# EAGLE design temp-sensor (EAGLE 9.6.2)
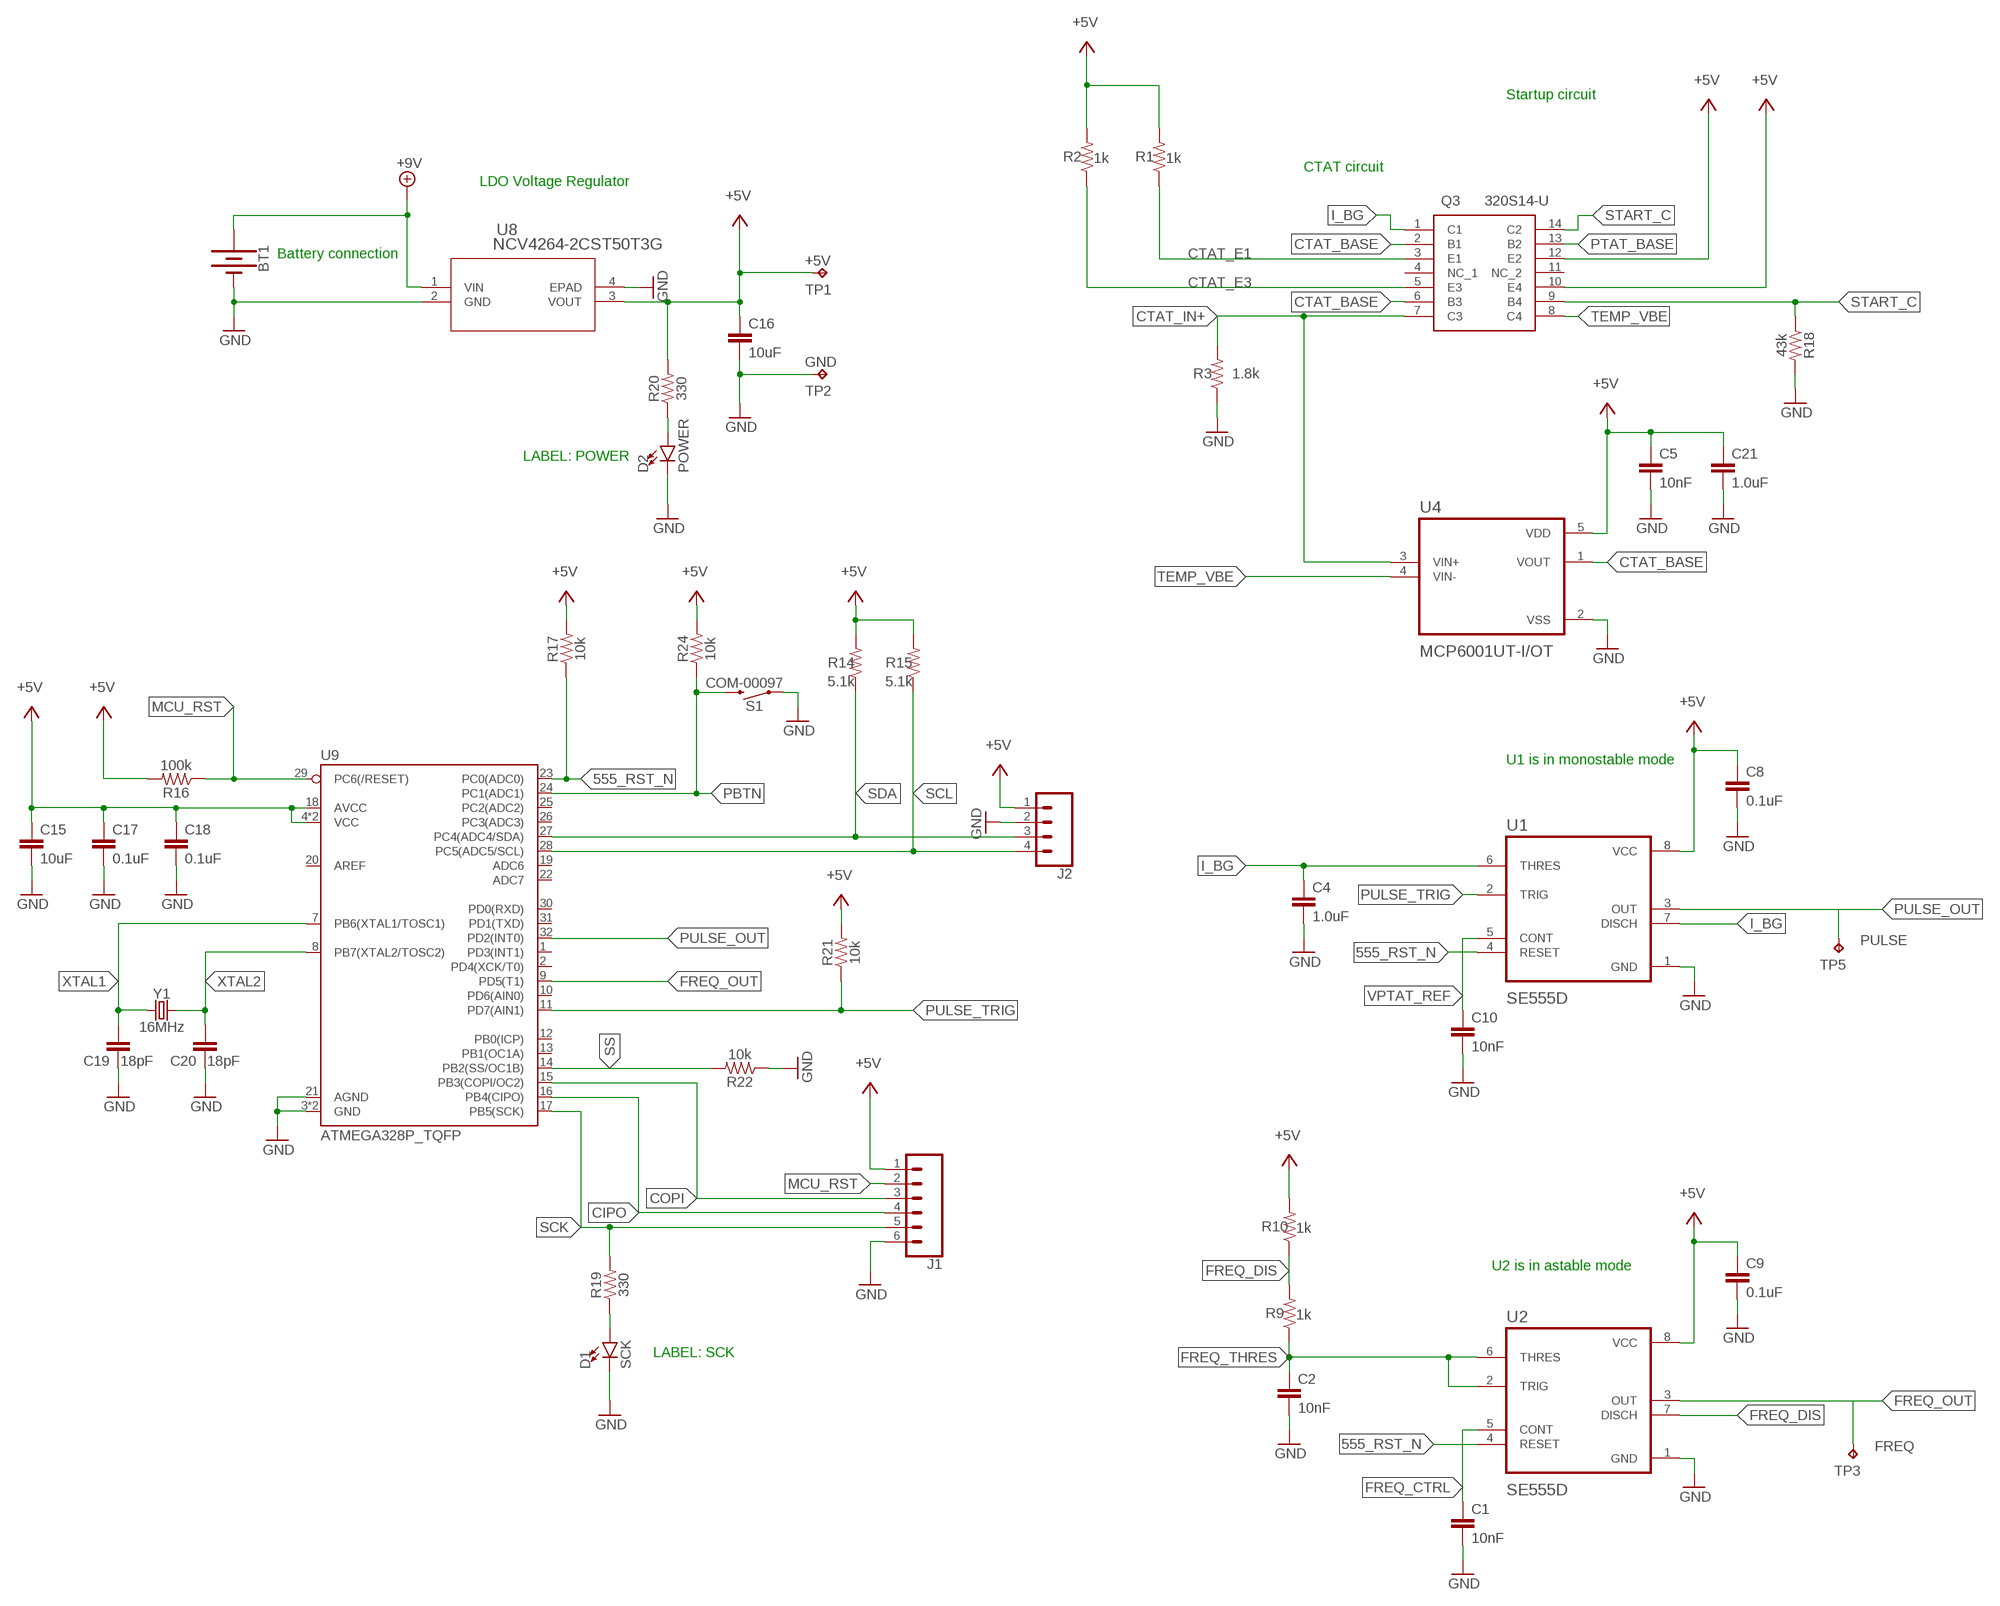
[diagram p0: schematic, sheet 1, part 1 of 2]
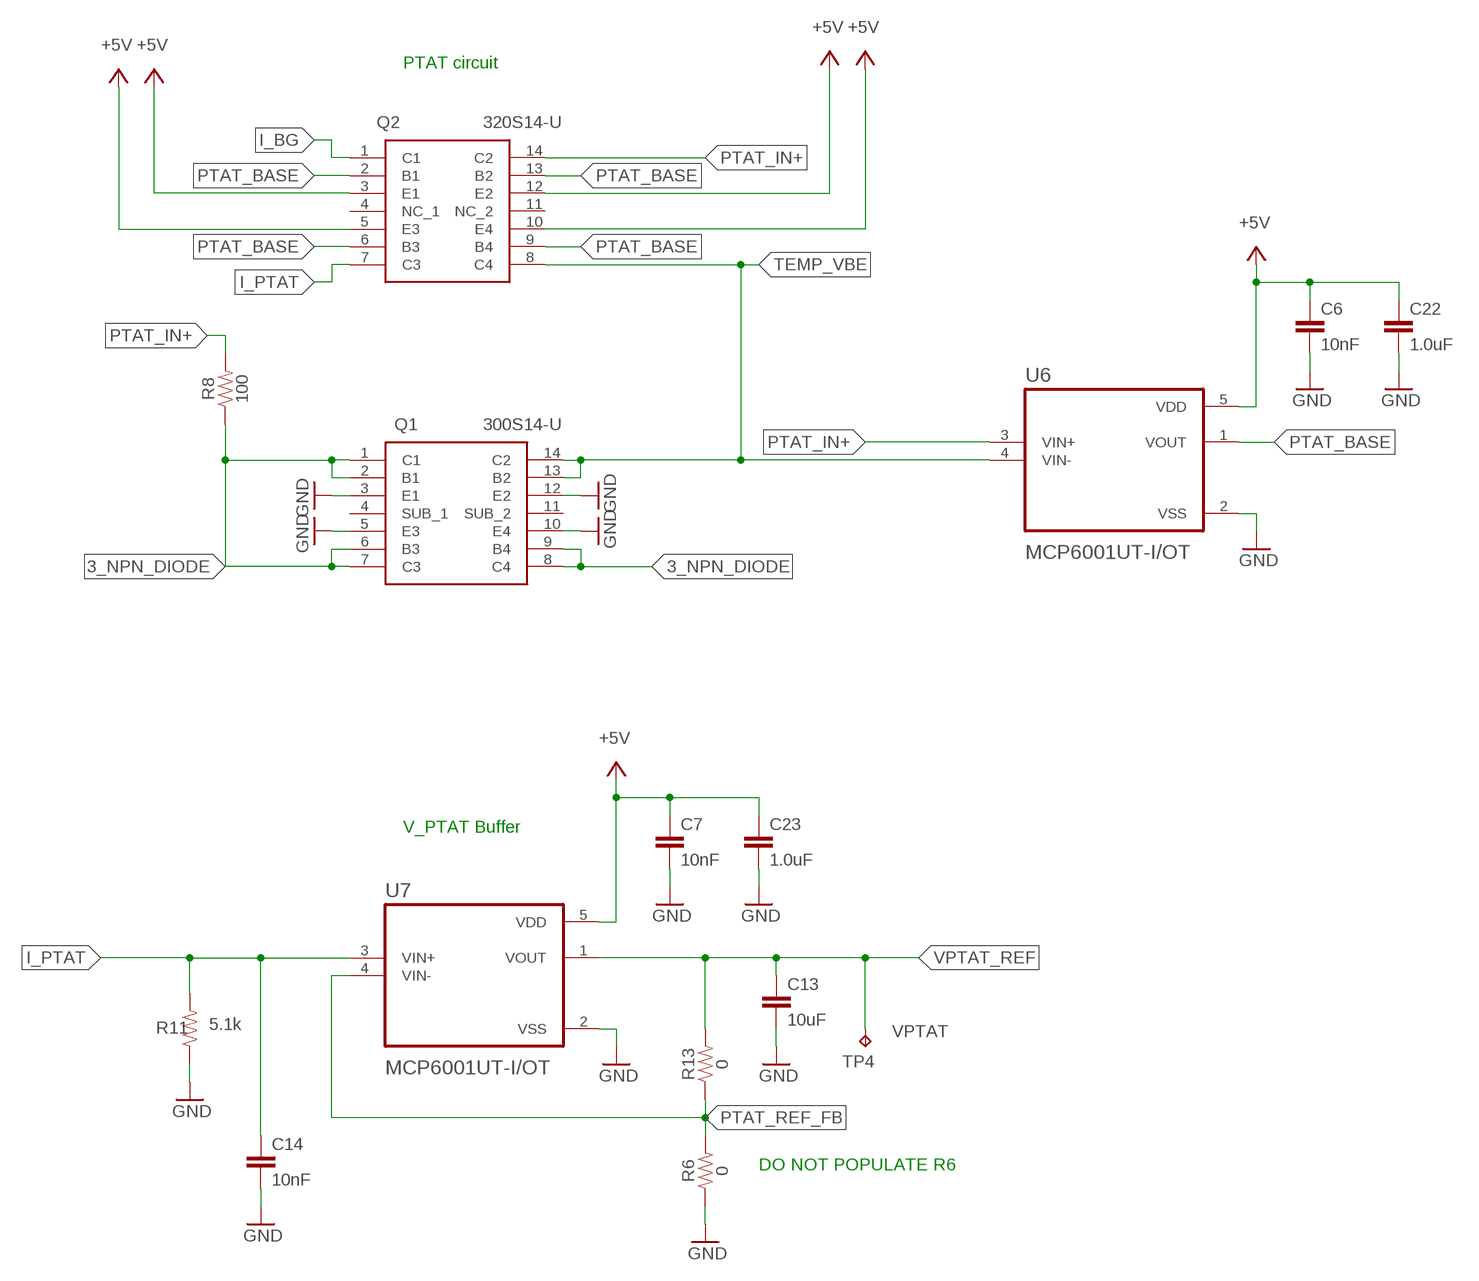
[diagram p1: schematic, sheet 1, part 2 of 2]

## Parts
BT1  BATTERY-9V  [BATTCON_9V]
C1  10nF  10NF-0603-50V-10%  [0603]
C2  10nF  10NF-0603-50V-10%  [0603]
C4  1.0uF  1.0UF-0603-16V-10%-X7R  [0603]
C5  10nF  10NF-0603-50V-10%  [0603]
C6  10nF  10NF-0603-50V-10%  [0603]
C7  10nF  10NF-0603-50V-10%  [0603]
C8  0.1uF  0.1UF-0603-25V-10%-X7R-WE  [0603]
C9  0.1uF  0.1UF-0603-25V-10%-X7R-WE  [0603]
C10  10nF  10NF-0603-50V-10%  [0603]
C13  10uF  10UF-0805-25V-10%  [0805]
C14  10nF  10NF-0603-50V-10%  [0603]
C15  10uF  10UF-0805-25V-10%  [0805]
C16  10uF  10UF-0805-25V-10%  [0805]
C17  0.1uF  0.1UF-0603-25V-10%-X7R-WE  [0603]
C18  0.1uF  0.1UF-0603-25V-10%-X7R-WE  [0603]
C19  18pF  18PF-0603-50V-5%  [0603]
C20  18pF  18PF-0603-50V-5%  [0603]
C21  1.0uF  1.0UF-0603-16V-10%-X7R  [0603]
C22  1.0uF  1.0UF-0603-16V-10%-X7R  [0603]
C23  1.0uF  1.0UF-0603-16V-10%-X7R  [0603]
D1  SCK  LED-GREEN1206  [LED-1206]
D2  POWER  LED-GREEN1206  [LED-1206]
J1  CONN_06SILK_FEMALE_PTH  [1X06]
J2  CONN_04PTH  [1X04]
Q1  300S14-U  [SOIC127P602X175-14N]
Q2  320S14-U  [SOIC127P602X175-14N]
Q3  320S14-U  [SOIC127P602X175-14N]
R1  1k  1KOHM-0603-1/10W-1%  [0603]
R2  1k  1KOHM-0603-1/10W-1%  [0603]
R3  1.8k  1.8KOHM-0603-1/10W-1%  [0603]
R6  0  0OHM-0603-1/10W  [0603]
R8  100  100OHM-0603-1/10W-1%  [0603]
R9  1k  1KOHM-0603-1/10W-1%  [0603]
R10  1k  1KOHM-0603-1/10W-1%  [0603]
R11  5.1k  5.1KOHM5.1KOHM-0603-1/10W-1%  [0603]
R13  0  0OHM-0603-1/10W  [0603]
R14  5.1k  5.1KOHM5.1KOHM-0603-1/10W-1%  [0603]
R15  5.1k  5.1KOHM5.1KOHM-0603-1/10W-1%  [0603]
R16  100k  100KOHM-0603-1/10W-1%  [0603]
R17  10k  10KOHM-0603-1/10W-1%  [0603]
R18  43k  43KOHM-0603-1/10W-1%  [0603]
R19  330  330OHM-0603-1/10W-1%  [0603]
R20  330  330OHM-0603-1/10W-1%  [0603]
R21  10k  10KOHM-0603-1/10W-1%  [0603]
R22  10k  10KOHM-0603-1/10W-1%  [0603]
R24  10k  10KOHM-0603-1/10W-1%  [0603]
S1  MOMENTARY-SWITCH-SPST-PTH-6.0MM  [TACTILE_SWITCH_PTH_6.0MM]
TP1  TPPAD1-13  [P1-13]
TP2  TPPAD1-13  [P1-13]
TP3  TPPAD1-13  [P1-13]
TP4  TPPAD1-13  [P1-13]
TP5  TPPAD1-13  [P1-13]
U1  SE555D  [SOIC127P599X175-8N]
U2  SE555D  [SOIC127P599X175-8N]
U4  MCP6001UT-I/OT  [SOT95P270X145-5N]
U6  MCP6001UT-I/OT  [SOT95P270X145-5N]
U7  MCP6001UT-I/OT  [SOT95P270X145-5N]
U8  NCV4264-2CST50T3G  [SOT-223_ONS]
U9  ATMEGA328P_TQFP  [TQFP32-08]
Y1  16MHz  CRYSTAL-16MHZSMD-5X3.2  [CRYSTAL-SMD-5X3.2-4PAD]

## Nets
3_NPN_DIODE: Q1.1(C1) Q1.2(B1) Q1.6(B3) Q1.7(C3) Q1.8(C4) Q1.9(B4) R8.1
555_RST_N: R17.1 U1.4(RESET) U2.4(RESET) U9.23(PC0(ADC0))
+5V: C5.1 C6.1 C7.1 C8.1 C9.1 C15.1 C16.1 C17.1 C18.1 C21.1 C22.1 C23.1 J1.1 J2.1 Q2.3(E1) Q2.5(E3) Q2.10(E4) Q2.12(E2) Q3.10(E4) Q3.12(E2) R1.2 R2.2 R10.2 R14.2 R15.2 R16.2 R17.2 R20.2 R21.2 R24.2 TP1.TP U1.8(VCC) U2.8(VCC) U4.5(VDD) U6.5(VDD) U7.5(VDD) U8.3(VOUT) U9.4(VCC) U9.6(VCC) U9.18(AVCC)
+9V: BT1.+ U8.1(VIN)
CIPO: J1.4 U9.16(PB4(CIPO))
COPI: J1.3 U9.15(PB3(COPI/OC2))
CTAT_BASE: Q3.2(B1) Q3.6(B3) U4.1(VOUT)
CTAT_E1: Q3.3(E1) R1.1
CTAT_E3: Q3.5(E3) R2.1
CTAT_IN+: Q3.7(C3) R3.2 U4.3(VIN+)
FREQ_CTRL: C1.1 U2.5(CONT)
FREQ_DIS: R9.2 R10.1 U2.7(DISCH)
FREQ_OUT: TP3.TP U2.3(OUT) U9.9(PD5(T1))
FREQ_THRES: C2.1 R9.1 U2.2(TRIG) U2.6(THRES)
GND: BT1.- C1.2 C2.2 C4.2 C5.2 C6.2 C7.2 C8.2 C9.2 C10.2 C13.2 C14.2 C15.2 C16.2 C17.2 C18.2 C19.1 C20.1 C21.2 C22.2 C23.2 D1.C D2.C J1.6 J2.2 Q1.3(E1) Q1.5(E3) Q1.10(E4) Q1.12(E2) R3.1 R6.1 R11.1 R18.2 R22.1 S1.1 TP2.TP U1.1(GND) U2.1(GND) U4.2(VSS) U6.2(VSS) U7.2(VSS) U8.2(GND) U8.4(EPAD) U9.3(GND) U9.5(GND) U9.21(AGND)
I_BG: C4.1 Q2.1(C1) Q3.1(C1) U1.6(THRES) U1.7(DISCH)
I_PTAT: C14.1 Q2.7(C3) R11.2 U7.3(VIN+)
MCU_RST: J1.2 R16.1 U9.29(PC6(/RESET))
N$2: D1.A R19.1
N$3: D2.A R20.1
PBTN: R24.1 S1.3 U9.24(PC1(ADC1))
PTAT_BASE: Q2.2(B1) Q2.6(B3) Q2.9(B4) Q2.13(B2) Q3.13(B2) U6.1(VOUT)
PTAT_IN+: Q2.14(C2) R8.2 U6.3(VIN+)
PTAT_REF_FB: R6.2 R13.1 U7.4(VIN-)
PULSE_OUT: TP5.TP U1.3(OUT) U9.32(PD2(INT0))
PULSE_TRIG: R21.1 U1.2(TRIG) U9.11(PD7(AIN1))
SCK: J1.5 R19.2 U9.17(PB5(SCK))
SCL: J2.4 R15.1 U9.28(PC5(ADC5/SCL))
SDA: J2.3 R14.1 U9.27(PC4(ADC4/SDA))
SS: R22.2 U9.14(PB2(SS/OC1B))
START_C: Q3.9(B4) Q3.14(C2) R18.1
TEMP_VBE: Q1.13(B2) Q1.14(C2) Q2.8(C4) Q3.8(C4) U4.4(VIN-) U6.4(VIN-)
VPTAT_REF: C10.1 C13.1 R13.2 TP4.TP U1.5(CONT) U7.1(VOUT)
XTAL1: C19.2 U9.7(PB6(XTAL1/TOSC1)) Y1.1
XTAL2: C20.2 U9.8(PB7(XTAL2/TOSC2)) Y1.3
Unconnected: Q1.4(SUB_1) Q1.11(SUB_2) Q2.4(NC_1) Q2.11(NC_2) Q3.4(NC_1) Q3.11(NC_2) U9.1(PD3(INT1)) U9.2(PD4(XCK/T0)) U9.10(PD6(AIN0)) U9.12(PB0(ICP)) U9.13(PB1(OC1A)) U9.19(ADC6) U9.20(AREF) U9.22(ADC7) U9.25(PC2(ADC2)) U9.26(PC3(ADC3)) U9.30(PD0(RXD)) U9.31(PD1(TXD))

## Notes on the sheet
- Startup circuit
- CTAT circuit | PTAT circuit
- LDO Voltage Regulator
- Battery connection
- LABEL: POWER
- U1 is in monostable mode
- V_PTAT Buffer
- DO NOT POPULATE R6
- U2 is in astable mode
- LABEL: SCK

## Library data of the parts
BT1 = SparkFun-Batteries:BATTERY: Battery - Single Cell A variety of battery chemistries, sizes, and footprints. Device List: 20MM_PTH - Coin Cell Battery Holder - 20mm (PTH) <https://www.sparkfun.com/products/783> 20MM_PTH_KIT- Coin Cell battery Holder - 20 mm (PTH) <http://www.sparkfun.com/products/783>kit version with special mask 6.8MM_PTH - Coin Cell Battery Holder - 6.8MM(SMD) <https://www.digikey.com/product-detail/en/seiko-instruments/MS621FE-FL11E/728-1057-ND/1889208?WT.srch=1&gclid=CNOQ5a6LzdQCFZS2wAodXCkE0g> 12MM_SMD - Coin Cell Battery Holder - 12mm (SMD) <https://www.sparkfun.com/products/10592> 12MM_PTH - Coin Cell Battery Holder - 12mm (PTH) <https://www.sparkfun.com/products/7948> 20MM_SMD - 20mm Coin Cell Battery Holder (SMD) (2 legs) Used on the Big Time Watch Kit <https://www.sparkfun.com/products/11734> 20MM_SMD_4LEGS - Coin Cell Battery Holder - 20mm (SMD) <https://www.sparkfun.com/products/11892> 20MM_SMD_4LEGS_OVERPASTE - Coin Cell Battery Holder - 20mm (SMD) <https://www.sparkfun.com/products/11892> (Over-paste on the legs) 24.5MM_PTH - Coin Cell Battery Holder - 24.5mm (PTH) <https://www.sparkfun.com/products/8863> 9V - 9V Battery Holder - PC Mount Used on the SparkFun SparkPunk Sound Kit <https://www.sparkfun.com/products/11177> and SparkFun SparkPunk Sequencer Kit <https://www.sparkfun.com/products/12707> 18650 - Battery Holder - 18650 (PTH) <https://www.sparkfun.com/products/13113> AA - Battery Holder - 1xAA (PTH) <https://www.sparkfun.com/products/7949> AAA - Battery Holder - 1xAAA (PTH) <https://www.sparkfun.com/products/12718> AA_KIT - Battery Holder - 1xAA (PTH) <https://www.sparkfun.com/products/7949> Special kit package - pads only have exposed copper on one side of the board. AAA_KIT - Battery Holder - 1xAAA (PTH) <https://www.sparkfun.com/products/12718> Special kit package - pads only have exposed copper on one side of the board.; PROD_ID: BATT-10855
C1 C2 C5-C7 C10 C14 = SparkFun-Capacitors:10NF: 0.01uF/10nF/10,000pF ceramic capacitors A capacitor is a passive two-terminal electrical component used to store electrical energy temporarily in an electric field. CAP-09321; PROD_ID: CAP-00867
C4 C21-C23 = SparkFun-Capacitors:1.0UF: 1µF ceramic capacitors A capacitor is a passive two-terminal electrical component used to store electrical energy temporarily in an electric field.; PROD_ID: CAP-13930
C8 C9 C17 C18 = SparkFun-Capacitors:0.1UF: 0.1µF ceramic capacitors A capacitor is a passive two-terminal electrical component used to store electrical energy temporarily in an electric field.; PROD_ID: CAP-16503
C13 C15 C16 = SparkFun-Capacitors:10UF: 10.0µF ceramic capacitors A capacitor is a passive two-terminal electrical component used to store electrical energy temporarily in an electric field.; PROD_ID: CAP-14259
C19 C20 = SparkFun-Capacitors:18PF: 18pF ceramic capacitors A capacitor is a passive two-terminal electrical component used to store electrical energy temporarily in an electric field.; PROD_ID: CAP-08267
D1 D2 = SparkFun-LED:LED-GREEN: Green SMD LED Used in manufacturing of various products at SparkFun Packages: 0603 - SMD 0603 package [Product Link] <http://www.futureelectronics.com/en/technologies/semiconductors/optoelectronics/leds/Pages/9894312-LTST-C190GKT.aspx?CrossPart=HSMG-C190&IM=0> LilyPad 1206 - SMD1206 LilyPad package [Product Link] <http://www.futureelectronics.com/en/Technologies/Product.aspx?ProductID=IN150NGHARVATEKCORPORATION2049943&IM=0> 1206 - SMD1206 package [Product Link] <http://www.futureelectronics.com/en/technologies/semiconductors/optoelectronics/leds/Pages/8315665-LTST-C150KGKT.aspx?IM=0> 1206 Bottom Mount -SMD 1206 Bottom Mount [Product Link] <http://www.digikey.com/product-detail/en/lite-on-inc/LTST-C230KGKT/160-1456-1-ND/386854> SparkFun Products: Pro Mini 328 -5V <https://www.sparkfun.com/products/821> RedBoard <https://www.sparkfun.com/products/12757> MP3 Trigger <https://www.sparkfun.com/products/13720> Makey Makey <https://www.sparkfun.com/products/11076>; PROD_ID: DIO-00862; VALUE: GREEN
J1 = SparkFun-Connectors:CONN_06: Multi connection point. Often used as Generic Header-pin footprint for 0.1 inch spaced/style header connections On any of the 0.1 inch spaced packages, you can populate with these: Break Away Headers - Straight <https://www.sparkfun.com/products/116> (PRT-00116) Break Away Male Headers - Right Angle <https://www.sparkfun.com/products/553> (PRT-00553) Female Headers <https://www.sparkfun.com/products/115> (PRT-00115) Break Away Headers - Machine Pin <https://www.sparkfun.com/products/117> (PRT-00117) Break Away Female Headers - Swiss Machine Pin <https://www.sparkfun.com/products/743> (PRT-00743) Arduino Stackable Header - 6 Pin <https://www.sparkfun.com/products/9280> (PRT-09280) Screw Terminals 2.54mm Pitch (6-Pin) <https://www.sparkfun.com/products/16499> (PRT-16499) For SCREWTERMINALS and SPRING TERMINALS visit here: Screw Terimnals on SparkFun.com <https://www.sparkfun.com/search/results?term=Screw+Terminals> (5mm/3.5mm/2.54mm spacing) This device is also useful as a general connection point to wire up your design to another part of your project. Our various solder wires solder well into these plated through hole pads. Hook-Up Wire - Assortment (Stranded, 22 AWG) <https://www.sparkfun.com/products/11375> (PRT-11375) Hook-Up Wire - Assortment (Solid Core, 22 AWG) <https://www.sparkfun.com/products/11367> (PRT-11367) View the entire wire category on our website here <https://www.sparkfun.com/categories/141>; PROD_ID: CONN-08437
J2 = SparkFun-Connectors:CONN_04: Multi connection point. Often used as Generic Header-pin footprint for 0.1 inch spaced/style header connections On any of the 0.1 inch spaced packages, you can populate with these: Break Away Headers - Straight <https://www.sparkfun.com/products/116> (PRT-00116) Break Away Male Headers - Right Angle <https://www.sparkfun.com/products/553> (PRT-00553) Female Headers <https://www.sparkfun.com/products/115> (PRT-00115) Break Away Headers - Machine Pin <https://www.sparkfun.com/products/117> (PRT-00117) Break Away Female Headers - Swiss Machine Pin <https://www.sparkfun.com/products/743> (PRT-00743) For SCREWTERMINALS and SPRING TERMINALS visit here: Screw Terimnals on SparkFun.com <https://www.sparkfun.com/search/results?term=Screw+Terminals> (5mm/3.5mm/2.54mm spacing) This device is also useful as a general connection point to wire up your design to another part of your project. Our various solder wires solder well into these plated through hole pads. Hook-Up Wire - Assortment (Stranded, 22 AWG) <https://www.sparkfun.com/products/11375> (PRT-11375) Hook-Up Wire - Assortment (Solid Core, 22 AWG) <https://www.sparkfun.com/products/11367> (PRT-11367) View the entire wire category on our website here <https://www.sparkfun.com/categories/141> Special notes: Molex polarized connector foot print use with SKU : PRT-08231 with associated crimp pins and housings. 1MM SMD Version SKU: PRT-10208; PROD_ID: CONN-09696
Q1 = 300S14-U:300S14-U: Bipolar Transistors - BJT 4 NPN Matched Trans. Array SO-14 Source: Datasheet; DESCRIPTION: Bipolar Transistors - BJT 4 NPN Matched Trans. Array SO-14; HEIGHT: 1.75mm; MANUFACTURER_NAME: THAT CORPORATION; MANUFACTURER_PART_NUMBER: 300S14-U; MOUSER_PART_NUMBER: 887-300S14-U; MOUSER_PRICE-STOCK: https://www.mouser.co.uk/ProductDetail/THAT/300S14-U?qs=wN%2Fcur4AVWdHgHcGlLafqA%3D%3D
Q2 Q3 = 320S14-U:320S14-U: Bipolar Transistors - BJT 4 PNP Matched Trans. Array SO-14 Source: Datasheet <http://www.thatcorp.com/datashts/THAT_300-Series_Datasheet.pdf>; DESCRIPTION: Bipolar Transistors - BJT 4 PNP Matched Trans. Array SO-14; HEIGHT: 1.75mm; MANUFACTURER_NAME: THAT CORPORATION; MANUFACTURER_PART_NUMBER: 320S14-U; MOUSER_PART_NUMBER: 887-320S14-U; MOUSER_PRICE-STOCK: https://www.mouser.co.uk/ProductDetail/THAT/320S14-U?qs=9Udfh7QmL4u%252BQY2LzA4HXA%3D%3D
R1 R2 R9 R10 = SparkFun-Resistors:1KOHM: 1kΩ resistor A resistor is a passive two-terminal electrical component that implements electrical resistance as a circuit element. Resistors act to reduce current flow, and, at the same time, act to lower voltage levels within circuits. - Wikipedia; PROD_ID: RES-07856
R3 = SparkFun-Resistors:1.8KOHM: 1.8kΩ resistor A resistor is a passive two-terminal electrical component that implements electrical resistance as a circuit element. Resistors act to reduce current flow, and, at the same time, act to lower voltage levels within circuits. - Wikipedia; PROD_ID: RES-09119
R6 R13 = SparkFun-Resistors:0OHM: 0Ω resistor A resistor is a passive two-terminal electrical component that implements electrical resistance as a circuit element. Resistors act to reduce current flow, and, at the same time, act to lower voltage levels within circuits. - Wikipedia; PROD_ID: RES-08609
R8 = SparkFun-Resistors:100OHM: 100Ω resistor A resistor is a passive two-terminal electrical component that implements electrical resistance as a circuit element. Resistors act to reduce current flow, and, at the same time, act to lower voltage levels within circuits. - Wikipedia; PROD_ID: RES-07863
R11 R14 R15 = SparkFun-Resistors:5.1KOHM; PROD_ID: RES-12083
R16 = SparkFun-Resistors:100KOHM: 100kΩ resistor A resistor is a passive two-terminal electrical component that implements electrical resistance as a circuit element. Resistors act to reduce current flow, and, at the same time, act to lower voltage levels within circuits. - Wikipedia; PROD_ID: RES-07828
R17 R21 R22 R24 = SparkFun-Resistors:10KOHM: 10kΩ resistor A resistor is a passive two-terminal electrical component that implements electrical resistance as a circuit element. Resistors act to reduce current flow, and, at the same time, act to lower voltage levels within circuits. - Wikipedia; PROD_ID: RES-00824
R18 = SparkFun-Resistors:43KOHM: 43kΩ resistor A resistor is a passive two-terminal electrical component that implements electrical resistance as a circuit element. Resistors act to reduce current flow, and, at the same time, act to lower voltage levels within circuits. - Wikipedia; PROD_ID: RES-07858
R19 R20 = SparkFun-Resistors:330OHM: 330Ω resistor A resistor is a passive two-terminal electrical component that implements electrical resistance as a circuit element. Resistors act to reduce current flow, and, at the same time, act to lower voltage levels within circuits. - Wikipedia; PROD_ID: RES-00818
S1 = SparkFun-Switches:MOMENTARY-SWITCH-SPST: Momentary Switch (Pushbutton) - SPST Normally-open (NO) SPST momentary switches (buttons, pushbuttons). Variants PTH-12MM - 12mm square, through-hole Momentary Pushbutton Switch - 12mm Square <https://www.sparkfun.com/products/9190> (COM-09190) PTH-6.0MM, PTH-6.0MM-KIT - 6.0mm square, through-hole Mini Pushbutton Switch <https://www.sparkfun.com/products/97> (COM-00097) KIT package intended for soldering kit's - only one side of pads' copper is exposed. PTH-RIGHT-ANGLE-KIT - Right-angle, through-hole Right Angle Tactile Button <https://www.sparkfun.com/products/10791> - Used on SparkFun BigTime Watch Kit <https://www.sparkfun.com/products/11734> SMD-12MM - 12mm square, surface-mount Tactile Button - SMD (12mm) <https://www.sparkfun.com/products/12993> (COM-12993) Used on SparkFun PicoBoard <https://www.sparkfun.com/products/11888> SMD-4.5MM - 4.5mm Square Trackball Switch Used on SparkFun Blackberry Trackballer Breakout <https://www.sparkfun.com/products/13169> SMD-4.6MMX2.8MM - 4.60mm x 2.80mm, surface mount Used on SparkFun Pro Micro - RP2040 <https://www.sparkfun.com/products/17717> SMD-5.2MM, SMD-5.2-REDUNDANT - 5.2mm square, surface-mount Mini Pushbutton Switch - SMD <https://www.sparkfun.com/products/8720> (COM-08720) Used on Arduino Pro Mini <https://www.sparkfun.com/products/11114> REDUNDANT package connects both switch circuits together SMD-6.0X3.5MM - 6.0 x 3.5mm, surface mount Momentary Reset Switch SMD <https://www.sparkfun.com/products/8229> (COM-08229) SMD-6.2MM-TALL - 6.2mm square, surface mount Tactile Button - SMD (6mm) <https://www.sparkfun.com/products/12992> Used on SparkFun Digital Sandbox <https://www.sparkfun.com/products/12651> SMD-RIGHT-ANGLE - Right-angle, surface mount Used on SparkFun Block for Intel® Edison - Arduino <https://www.sparkfun.com/products/13036>; PROD_ID: SWCH-08441; SF_SKU: COM-00097
TP1 = testpad:TP: Test pad; TP_SIGNAL_NAME: +5V
TP2 = testpad:TP: Test pad; TP_SIGNAL_NAME: GND
TP3 = testpad:TP: Test pad; TP_SIGNAL_NAME: FREQ
TP4 = testpad:TP: Test pad; TP_SIGNAL_NAME: VPTAT
TP5 = testpad:TP: Test pad; TP_SIGNAL_NAME: PULSE
U1 U2 = SE555D:SE555D: None Check availability <https://pricing.snapeda.com/parts/SE555D/Texas%20Instruments/view-part?ref=eda>; AVAILABILITY: In Stock; CHECK_PRICES: https://www.snapeda.com/parts/SE555D/Texas+Instruments/view-part/?ref=eda; DESCRIPTION: Precision timer for -55 to 125C operation; MF: Texas Instruments; MP: SE555D; PACKAGE: SOIC-8 Texas Instruments; PRICE: None; PURCHASE-URL: https://www.snapeda.com/api/url_track_click_mouser/?unipart_id=4805641&manufacturer=Texas Instruments&part_name=SE555D&search_term=se555d; SNAPEDA_LINK: https://www.snapeda.com/parts/SE555D/Texas+Instruments/view-part/?ref=snap
U4 U6 U7 = MCP6001UT-I_OT:MCP6001UT-I/OT
U8 = NCV4264-2CST50T3G:NCV4264-2CST50T3G; COPYRIGHT: Copyright (C) 2024 Ultra Librarian. All rights reserved.; MANUFACTURER_PART_NUMBER: NCV4264-2CST50T3G; MFR_NAME: onsemi
U9 = SparkFun-IC-Microcontroller:ATMEGA328P_TQFP: Popular 328P in QFP Storefront component: ATmega328 - TQFP <https://www.sparkfun.com/products/13448> (COM-13448) Datasheet <http://www.sparkfun.com/datasheets/Components/SMD/ATMega328.pdf> SparkFun Products SparkFun RedBoard - Programmed with Arduino <https://www.sparkfun.com/products/12757> (DEV-12757) Arduino Pro Mini 328 - 5V/16MHz <https://www.sparkfun.com/products/11113> (DEV-11113) Arduino Pro Mini 328 - 3.3V/8MHz <https://www.sparkfun.com/products/11114> (DEV-11114) SparkFun OpenLog <https://www.sparkfun.com/products/13712> (DEV-13712) SparkFun MicroView - OLED Arduino Module <https://www.sparkfun.com/products/12923> (DEV-12923) SparkFun Digital Sandbox <https://www.sparkfun.com/products/12651> (DEV-12651) SparkFun PicoBoard <https://www.sparkfun.com/products/11888> (WIG-11888) Arduino Fio <https://www.sparkfun.com/products/10116> (DEV-10116) LilyPad Arduino 328 Main Board <https://www.sparkfun.com/products/13342> (DEV-13342) SparkFun RedStick <https://www.sparkfun.com/products/13741> (DEV-13741) LilyPad MP3 <https://www.sparkfun.com/products/11013> (DEV-11013) LilyPad Arduino SimpleSnap <https://www.sparkfun.com/products/10941> (DEV-10941) SparkFun Stepoko <https://www.sparkfun.com/products/13899> (ROB-13899) SparkFun Geiger Counter <https://www.sparkfun.com/products/11345> (SEN-11345) SparkFun EL Sequencer <https://www.sparkfun.com/products/12781> (COM-12781) Arduino Pro 328 - 5V/16MHz <https://www.sparkfun.com/products/10915> (DEV-10915) CryptoCape <https://www.sparkfun.com/products/12773> (DEV-12773) SparkFun IR Thermometer Evaluation Board - MLX90614 <https://www.sparkfun.com/products/10740> (SEN-10740) SparkFun RedBot Mainboard <https://www.sparkfun.com/products/12097> (ROB-12097) Arduino Pro 328 - 3.3V/8MHz <https://www.sparkfun.com/products/10914> (DEV-10914) SparkFun Block for Intel® Edison - Arduino <https://www.sparkfun.com/products/13036> (DEV-13036) SparkFun Simon Says - Surface Mount Soldering Kit <https://www.sparkfun.com/products/10935> (KIT-10935) SparkFun 7-Segment Serial Display - Red <https://www.sparkfun.com/products/11441> (COM-11441) SparkFun 7-Segment Serial Display - White <https://www.sparkfun.com/products/11629> (COM-11629) SparkFun 7-Segment Serial Display - Yellow <https://www.sparkfun.com/products/11443> (COM-11443) SparkFun 7-Segment Serial Display - Kelly Green <https://www.sparkfun.com/products/11440> (COM-11440) SparkFun 7-Segment Serial Display - Blue <https://www.sparkfun.com/products/11442> (COM-11442) SparkFun OpenSegment Serial Display - 20mm (Blue) <https://www.sparkfun.com/products/11647> (COM-11647) SparkFun OpenSegment Serial Display - 20mm (Green) <https://www.sparkfun.com/products/11646> (COM-11646) SparkFun OpenSegment Serial Display - 20mm (White) <https://www.sparkfun.com/products/11648> (COM-11648) SparkFun OpenSegment Serial Display - 20mm (Red) <https://www.sparkfun.com/products/11644> (COM-11644) SparkFun OpenSegment Serial Display - 20mm (Yellow) <https://www.sparkfun.com/products/11645> (COM-11645) SparkFun OpenSegment Shield <https://www.sparkfun.com/products/13190> (DEV-13190); PROD_ID: IC-09069
Y1 = SparkFun-Clocks:CRYSTAL-16MHZ: 16MHz Crystal Digikey Example <http://www.digikey.com/product-search/en?keywords=535-9122-1-ND> Frequency: 16MHz Frequency Stability: ±50ppm Frequency Tolerance: ±20ppm Load Capacitance: 18pF SparkFun Products: Pro Micro -5V/16MHz <https://www.sparkfun.com/products/12640> SparkFun Serial Enabled LCD Kit <https://www.sparkfun.com/products/10097>; PROD_ID: XTAL-08218; SF_ID: COM-00094

## Board
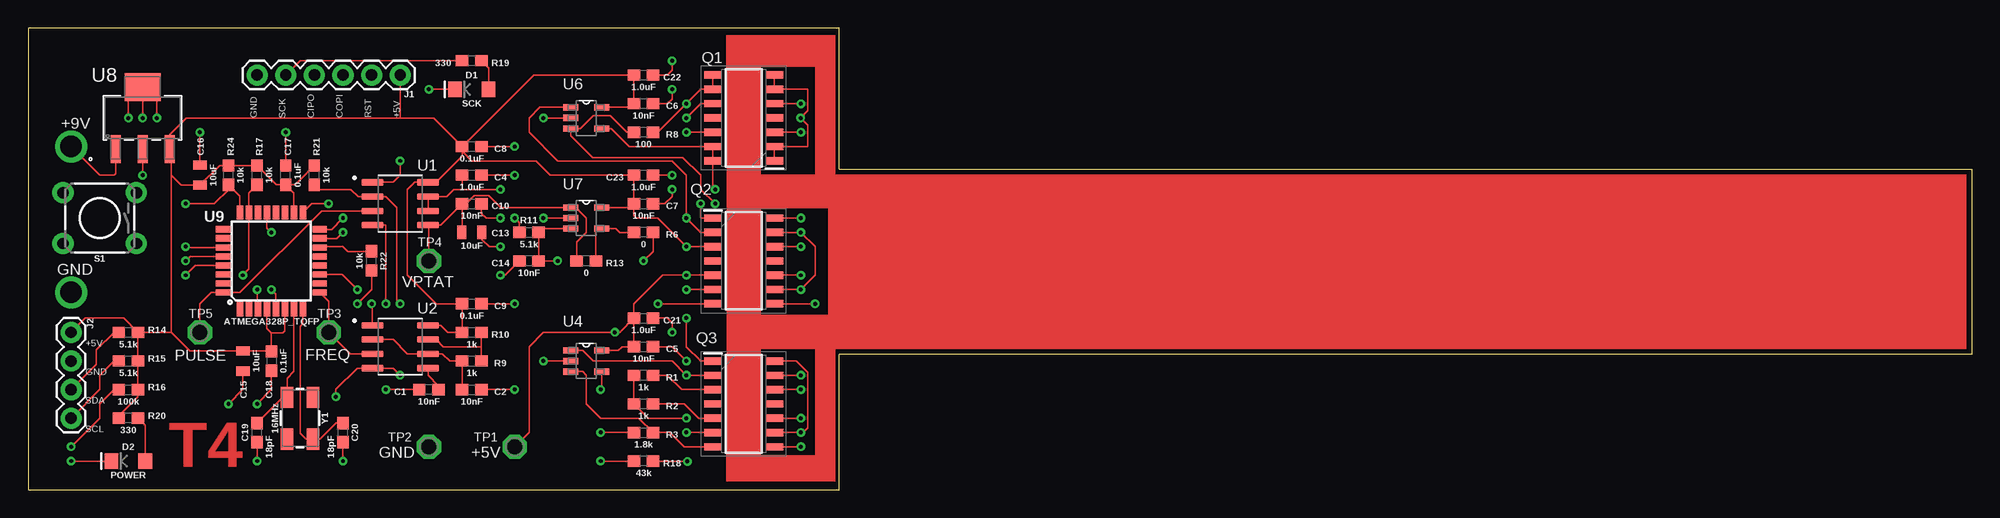
[diagram p2: board, top side]
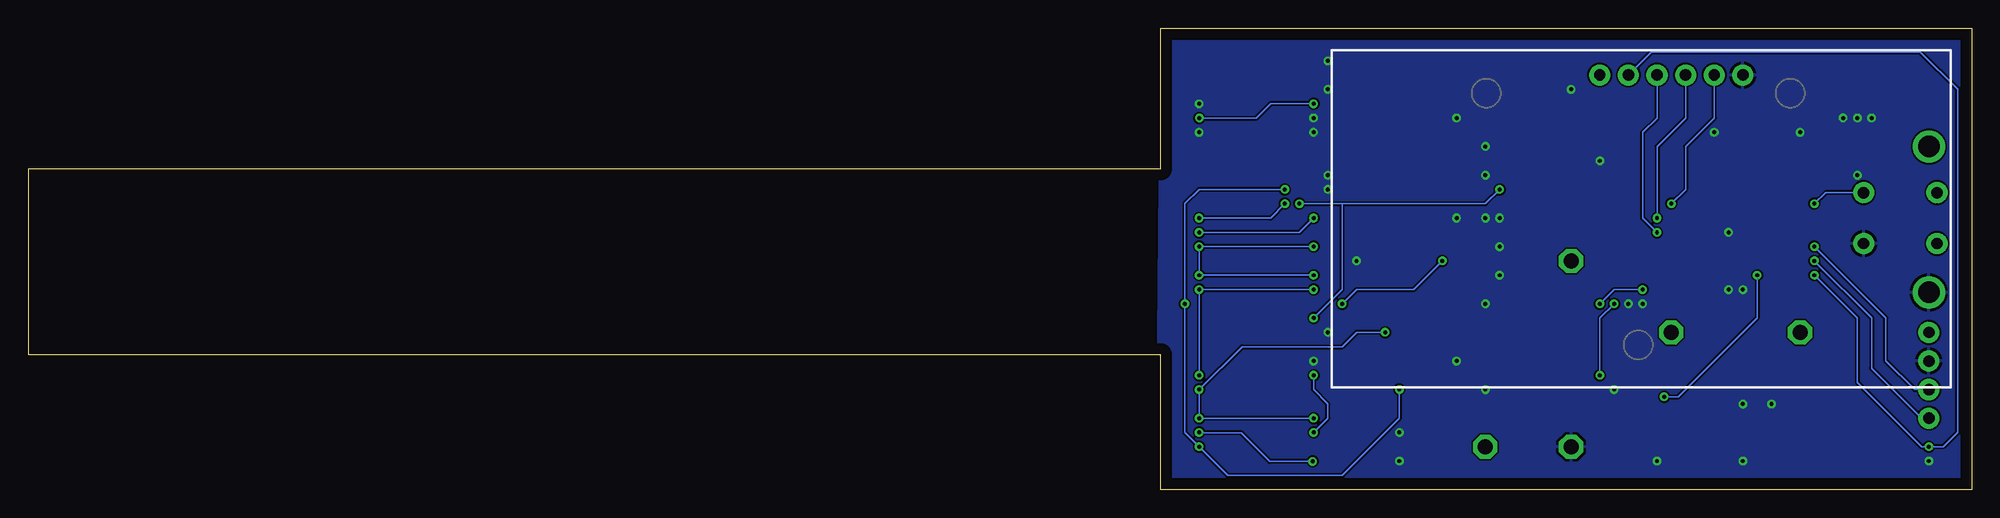
[diagram p3: board, bottom side, seen from below]

Size 172.5 x 41 mm. Coordinates in mm from the lower left corner, seen from the top.
Outline: 0,0 72,0 72,12 172.5,12 172.5,28.5 72,28.5 72,41 0,41 0,0
Copper layers (1*16): Top 0.035mm / dielectric 1.5mm / Bottom 0.035mm
Design rules "default": minimum track width 6mil, minimum drill 0.35mm, track to track 6mil, track to pad 6mil, pad to pad 6mil, via to via 6mil, smd to smd 6mil, copper to edge 40mil, drill to drill 6mil, minimum pad ring 10mil, minimum via ring 8mil, stop-mask expansion 4mil, vias tented up to drill 0mil, thermal gap 10mil

### Footprints (pad centres in the part's own frame; a part is rotated, then mirrored left to right if it is on the bottom)
BATTCON_9V = drill 1.905: + 0,0; - 0,-12.954
0603 = smd 1.1 x 1: 1 -0.85,0; 2 0.85,0
0805 = smd 0.8 x 1.2: 1 -0.9,0; 2 0.9,0
LED-1206 = smd 1.2 x 1.4: A -1.5,0; C 1.5,0
1X06 = drill 1.016 pad 1.88: 1 0,0; 2 2.54,0; 3 5.08,0; 4 7.62,0; 5 10.16,0; 6 12.7,0
1X04 = drill 1.016 pad 1.88: 1 0,0; 2 2.54,0; 3 5.08,0; 4 7.62,0
SOIC127P602X175-14N = smd 1.545 x 0.65: 1 -2.728,3.81; 2 -2.728,2.54; 3 -2.728,1.27; 4 -2.728,0; 5 -2.728,-1.27; 6 -2.728,-2.54; 7 -2.728,-3.81; 8 2.728,-3.81; 9 2.728,-2.54; 10 2.728,-1.27; 11 2.728,0; 12 2.728,1.27; 13 2.728,2.54; 14 2.728,3.81
TACTILE_SWITCH_PTH_6.0MM = drill 1.016 pad 1.88: 1 -3.251,2.261; 2 3.251,2.261; 3 -3.251,-2.261; 4 3.251,-2.261
P1-13 = drill 1.321 pad 2.159 octagon: TP 0,0
SOIC127P599X175-8N = smd 1.97 x 0.6: 1 -2.47,1.905; 2 -2.47,0.635; 3 -2.47,-0.635; 4 -2.47,-1.905; 5 2.47,-1.905; 6 2.47,-0.635; 7 2.47,0.635; 8 2.47,1.905
SOT95P270X145-5N = smd 1.321 x 0.559: 1 -1.372,0.94; 2 -1.372,0; 3 -1.372,-0.94; 4 1.372,-0.94; 5 1.372,0.94
SOT-223_ONS = smd 0.889 x 2.489: 1 -2.4,-2.756; 2 0,-2.756; 3 2.4,-2.756 | smd 3.2 x 2.489: 4 0,2.756
TQFP32-08 = smd 1.27 x 0.559: 1 -4.293,2.8; 2 -4.293,2; 3 -4.293,1.2; 4 -4.293,0.4; 5 -4.293,-0.4; 6 -4.293,-1.2; 7 -4.293,-2; 8 -4.293,-2.8; 17 4.293,-2.8; 18 4.293,-2; 19 4.293,-1.2; 20 4.293,-0.4; 21 4.293,0.4; 22 4.293,1.2; 23 4.293,2; 24 4.293,2.8 | smd 0.559 x 1.27: 9 -2.8,-4.293; 10 -2,-4.293; 11 -1.2,-4.293; 12 -0.4,-4.293; 13 0.4,-4.293; 14 1.2,-4.293; 15 2,-4.293; 16 2.8,-4.293; 25 2.8,4.293; 26 2,4.293; 27 1.2,4.293; 28 0.4,4.293; 29 -0.4,4.293; 30 -1.2,4.293; 31 -2,4.293; 32 -2.8,4.293
CRYSTAL-SMD-5X3.2-4PAD = smd 1.9 x 1.1: 1 -1.85,-1.15; 2 1.85,-1.15; 3 1.85,1.15; 4 -1.85,1.15

### Placement (x,y rotation side)
BT1  3.81,30.48 0 bottom
C1  35.56,8.89 180 top
C2  39.37,8.89 0 top
C4  39.37,27.94 0 top
C5  54.61,12.7 0 top
C6  54.61,34.29 0 top
C7  54.61,25.4 0 top
C8  39.37,30.48 0 top
C9  39.37,16.51 0 top
C10  39.37,25.4 0 top
C13  39.37,22.86 0 top
C14  44.45,20.32 180 top
C15  19.05,11.43 270 top
C16  15.24,27.94 90 top
C17  22.86,27.94 90 top
C18  21.59,11.43 270 top
C19  20.32,5.08 90 top
C20  27.94,5.08 90 top
C21  54.61,15.24 0 top
C22  54.61,36.83 0 top
C23  54.61,27.94 0 top
D1  39.37,35.56 180 top
D2  8.89,2.54 180 top
J1  33.02,36.83 180 top
J2  3.81,13.97 270 top
Q1  63.5,33.02 180 top
Q2  63.5,20.32 0 top
Q3  63.5,7.62 0 top
R1  54.61,10.16 180 top
R2  54.61,7.62 180 top
R3  54.61,5.08 0 top
R6  54.61,22.86 180 top
R8  54.61,31.75 180 top
R9  39.37,11.43 0 top
R10  39.37,13.97 180 top
R11  44.45,22.86 0 top
R13  49.53,20.32 180 top
R14  8.89,13.97 0 top
R15  8.89,11.43 0 top
R16  8.89,8.89 0 top
R17  20.32,27.94 90 top
R18  54.61,2.54 180 top
R19  39.37,38.1 180 top
R20  8.89,6.35 180 top
R21  25.4,27.94 90 top
R22  30.48,20.32 90 top
R24  17.78,27.94 90 top
S1  6.35,24.13 180 top
TP1  43.18,3.81 0 top
TP2  35.56,3.81 0 top
TP3  26.67,13.97 180 top
TP4  35.56,20.32 0 top
TP5  15.24,13.97 0 top
U1  33.02,25.4 0 top
U2  33.02,12.7 0 top
U4  49.53,11.43 0 top
U6  49.53,33.02 0 top
U7  49.53,24.13 0 top
U8  10.16,33.02 0 top
U9  21.59,20.32 90 top
Y1  24.13,6.35 270 top

### Tracks (layer width: path | path; a pad name or v marks a point on that pad's centre or on a via)
3_NPN_DIODE  (via drill 0.35)
  Top 0.152: Q1.8 Q1.9 59.69,35.56 v58.42,34.29 55.88,31.75 R8.1 | Q1.7 Q1.6 69.2,35.56 69.2,33.66 v68.56,33.02 69.2,32.38 69.2,30.48 Q1.2 Q1.1
  Bottom 0.152: v58.42,34.29 62.23,34.29 63.5,33.02 v68.56,33.02
555_RST_N  (via drill 0.35)
  Top 0.152: v19.05,19.05 19.59,19.59 U9.23 19.59,26.36 R17.1 | v27.3,8.26 27.3,8.89 29.21,10.79 U2.4 32.38,10.79 v33.02,10.16 | v31.75,16.51 31.75,23.5 U1.4
  Bottom 0.152: v27.3,8.26 26.04,8.26 19.05,15.24 v19.05,19.05 | v31.75,16.51 33.02,15.24 v33.02,10.16
+5V  (via drill 0.35)
  Top 0.152: U4.5 52.38,12.37 52.7,12.7 C5.1 C21.1 | C7.1 53.43,25.07 U7.5 | C7.1 C23.1 46.35,27.94 45.09,29.21 39.37,29.21 38.52,30.06 C8.1 | U6.5 53.43,33.96 C6.1 C22.1 44.87,36.83 C8.1 | C8.1 38.52,29.63 36.2,27.3 U1.8 34.29,27.3 33.66,26.67 33.66,19.05 36.2,16.51 C9.1 R10.2 37.25,13.97 36.62,14.61 U2.8 | C17.1 22.02,27.09 R17.2 R24.2 16.99,28.79 C16.1 13.6,27.04 12.7,27.94 | C17.1 23.7,27.09 R21.2 | R20.2 8.04,6.55 9.74,8.26 R16.2 R15.2 R14.2 | 12.7,27.94 12.7,30.12 U8.3 12.56,31.53 14.05,33.02 33.02,33.02 | C7.1 53.76,24.34 53.98,24.13 55.88,24.13 v58.42,21.59 Q2.3 | Q2.5 v58.42,19.05 56.3,19.05 53.76,16.51 C21.1 | C8.1 35.98,33.02 33.02,33.02 | 33.02,33.02 J1.1 | U9.18 23.59,26.36 C17.1 | J2.1 5.08,15.24 8.47,15.24 R14.2 | R1.2 R2.2 55.03,6.35 v58.42,6.35 | v68.58,21.59 Q2.12 | v68.58,19.05 Q2.10 | Q3.12 v68.58,8.89 | 12.7,27.94 12.7,13.97 | Q3.10 v68.58,6.35 | C21.1 52.49,13.97 v52.07,13.97 45.72,13.97 44.45,12.7 44.45,5.08 TP1.TP | 12.7,13.97 14.34,12.33 C15.1 21.54,12.33 C18.1 21.59,13.92 | U9.4 21.19,14.32 21.59,13.92 | U9.6 22.79,14.12 22.59,13.92 21.59,13.92 | R14.2 12.7,13.97
  Bottom 0.152: v58.42,21.59 v68.58,21.59 v68.58,19.05 v58.42,19.05 | v58.42,6.35 v68.58,6.35 v68.58,8.89 64.77,12.7 55.88,12.7 54.61,13.97 v52.07,13.97
+9V
  Top 0.152: BT1.+ 6.35,27.94 7.62,27.94 7.76,28.08 U8.1
CIPO  (via drill 0.35)
  Top 0.152: U9.16 26.93,23.12 v27.94,24.13
  Bottom 0.152: J1.4 25.4,33.02 27.94,30.48 v27.94,24.13
COPI  (via drill 0.35)
  Top 0.152: U9.15 27.4,22.32 v27.94,22.86
  Bottom 0.152: v27.94,22.86 29.21,24.13 29.21,31.75 27.94,33.02 J1.3
CTAT_BASE  (via drill 0.35)
  Top 0.152: Q3.2 v58.42,10.16 57.15,11.43 50.16,11.43 49.23,12.37 U4.1 | Q3.6 v58.42,5.08
  Bottom 0.152: v58.42,5.08 57.15,6.35 57.15,7.62 58.42,8.89 v58.42,10.16
CTAT_E1
  Top 0.152: R1.1 56.73,10.16 58,8.89 Q3.3
CTAT_E3
  Top 0.152: Q3.5 59.5,6.35 58.23,7.62 R2.1
CTAT_IN+
  Top 0.152: Q3.7 58.23,3.81 56.96,5.08 R3.2 54.19,6.35 50.8,6.35 49.53,7.62 49.53,10.16 49.2,10.49 U4.3
FREQ_CTRL
  Top 0.152: U2.5 35.49,10.16 36.41,9.24 C1.1
FREQ_DIS
  Top 0.152: R9.2 R10.1 40.22,12.7 36.83,12.7 36.2,13.34 U2.7
FREQ_OUT
  Top 0.152: U9.9 26.67,16.73 TP3.TP 28.57,12.06 U2.3
FREQ_THRES
  Top 0.152: U2.2 32.38,13.34 33.66,12.06 U2.6 36.76,12.06 37.4,11.43 R9.1 C2.1
GND  (via drill 0.35)
  Top 0.152: C20.1 v27.94,2.54 | C19.1 v20.32,2.54 | U9.5 21.99,17.38 v21.59,17.78 | U9.21 21.19,23.26 v21.59,22.86 | C2.2 v43.18,8.89 | U4.2 v45.72,11.43 | Q1.5 v68.58,34.29 | Q1.3 v68.58,31.75 | C22.2 56.73,36.83 57.15,37.25 v57.15,38.1 | C6.2 56.73,34.29 57.15,34.71 v57.15,35.56 | C5.2 57.15,12.7 v58.42,11.43 | v57.15,13.97 57.15,14.82 56.73,15.24 C21.2 | R6.1 55.46,21.17 v54.61,20.32 | C7.2 56.52,25.4 57.15,26.04 v57.15,26.67 | C23.2 v57.15,27.94 | C10.2 40.22,24.55 40.64,24.13 v41.91,24.13 | C13.2 40.27,22.23 40.91,21.59 v41.91,21.59 | R11.1 43.6,23.71 v43.18,24.13 | C14.2 42.33,19.05 v41.91,19.05 | U6.2 v45.72,33.02 | C8.2 v43.18,30.48 | D1.C v35.56,35.56 | U8.4 v10.16,33.02 | U8.4 11.43,34.51 v11.43,33.02 | U8.4 8.89,34.51 v8.89,33.02 | U8.2 v10.16,27.94 | R3.1 v50.8,5.08 | C16.2 v15.24,31.75 | C17.2 v22.86,31.75 | D2.C v3.81,2.54 | C1.2 v31.75,8.89 | U2.1 30.55,16.44 v30.48,16.51 | U1.1 32.38,27.3 33.02,27.94 v33.02,29.21 | C9.2 v43.18,16.51 | U7.2 v45.72,24.13 | U9.3 20.32,16.1 v20.32,17.78 | C4.2 v43.18,27.94 | v17.78,7.62 19.05,8.89 C15.2 | C18.2 21.59,8.89 v20.32,7.62 | R22.1 30.48,17.78 v29.21,16.51 | Q1.12 v58.42,31.75 | Q1.10 59.69,34.29 v58.42,33.02 | R18.2 v50.8,2.54
  pour Bottom: 0,41 0,0 72.39,0 71.99,41
I_BG  (via drill 0.35)
  Top 0.152: Q2.1 59.69,24.13 v59.69,25.4 | v41.91,26.67 38.52,26.67 | 38.52,26.67 C4.1 | U1.6 U1.7 37.15,26.04 37.78,26.67 38.52,26.67 | v58.42,15.24 58.42,12.7 59.69,11.43 Q3.1
  Bottom 0.152: v59.69,25.4 55.88,25.4 | 55.88,25.4 43.18,25.4 v41.91,26.67 | 55.88,25.4 55.88,17.78 v58.42,15.24
I_PTAT  (via drill 0.35)
  Top 0.152: v55.88,16.51 Q2.7 | v46.99,20.32 C14.1 R11.2 45.63,23.19 U7.3
  Bottom 0.152: v55.88,16.51 54.61,17.78 49.53,17.78 v46.99,20.32
MCU_RST  (via drill 0.35)
  Top 0.152: U9.29 14.84,19.92 v13.97,19.05 | v3.81,3.81 6.35,6.35 6.35,7.62 7.62,8.89 R16.1
  Bottom 0.152: J1.2 28.44,38.87 4.58,38.87 1.27,35.56 1.27,5.08 2.54,3.81 v3.81,3.81 4.45,3.81 10.16,9.53 10.16,15.24 v13.97,19.05
N$2
  Top 0.152: R19.1 40.87,37.45 D1.A
N$3
  Top 0.152: D2.A 10.39,5.7 R20.1
PBTN  (via drill 0.35)
  Top 0.152: U9.24 18.79,26.08 R24.1 17.78,26.67 16.51,25.4 v13.97,25.4
  Bottom 0.152: S1.3 12.98,26.39 v13.97,25.4
PTAT_BASE  (via drill 0.35)
  Top 0.152: Q2.2 59.69,22.86 v58.42,24.13 58.42,27.94 57.15,29.21 46.99,29.21 44.45,31.75 44.45,33.02 45.39,33.96 U6.1 | Q2.13 v68.58,22.86 69.85,21.59 69.85,19.05 v68.58,17.78 Q2.9 | v58.42,17.78 Q2.6 | v68.58,10.16 Q3.13
  Bottom 0.152: v58.42,24.13 59.69,22.86 v68.58,22.86 | v68.58,10.16 v68.58,17.78 v58.42,17.78
PTAT_IN+  (via drill 0.35)
  Top 0.152: R8.2 53.14,31.75 51.66,33.22 50.15,33.22 49,32.08 U6.3 48.16,31.45 50.09,29.52 58.12,29.52 59.69,27.94 59.69,26.67 v60.96,25.4 | v68.58,24.13 Q2.14
  Bottom 0.152: v68.58,24.13 62.23,24.13 v60.96,25.4
PTAT_REF_FB
  Top 0.152: R13.1 50.38,23.19 U7.4 52.16,23.19 52.49,22.86 R6.2
PULSE_OUT
  Top 0.152: U1.3 26.04,24.77 18.79,17.52 U9.32 16.25,17.52 15.24,16.51 TP5.TP
PULSE_TRIG  (via drill 0.35)
  Top 0.152: R21.1 25.82,26.67 28.64,26.67 29.28,26.04 U1.2 31.75,26.04 32.72,25.07 32.72,16.82 v33.02,16.51 | U9.11 27.87,19.12 v29.21,17.78
  Bottom 0.152: v33.02,16.51 31.75,17.78 v29.21,17.78
SCK  (via drill 0.35)
  Top 0.152: R19.2 24.13,38.1 J1.5 | U9.17 25.18,25.4 v26.67,25.4
  Bottom 0.152: v26.67,25.4 25.4,26.67 25.4,30.48 22.86,33.02 J1.5
SCL  (via drill 0.35)
  Top 0.152: J2.4 6.35,8.89 6.35,10.16 7.62,11.43 R15.1 | v13.97,20.32 14.37,20.72 U9.28
  Bottom 0.152: J2.4 4.45,6.35 8.89,10.79 8.89,15.24 v13.97,20.32
SDA  (via drill 0.35)
  Top 0.152: J2.3 6.04,11.12 6.04,12.39 7.62,13.97 R14.1 | v13.97,21.59 14.04,21.52 U9.27
  Bottom 0.152: J2.3 5.08,8.89 7.62,11.43 7.62,15.24 v13.97,21.59
SS
  Top 0.152: U9.14 25.95,21.59 27.94,21.59 28.36,21.17 R22.2
START_C  (via drill 0.35)
  Top 0.152: Q3.9 v68.58,5.08 68.77,5.08 69.19,5.5 69.19,10.41 68.17,11.43 Q3.14 | v58.5,2.5 55.5,2.5 R18.1
  Bottom 0.152: v58.5,2.5 62.31,2.5 64.85,5.04 68.54,5.04 v68.58,5.08
TEMP_VBE  (via drill 0.35)
  Top 0.152: U6.4 51.74,32.08 53.34,30.48 Q1.13 Q1.14 60.77,26.86 v60.96,26.67 | U4.4 50.9,8.99 v50.8,8.89 | Q2.8 v69.85,16.51 | v68.58,3.81 Q3.8
  Bottom 0.152: v50.8,8.89 50.8,6.35 55.88,1.27 66.04,1.27 v68.58,3.81 69.85,5.08 v69.85,16.51 69.85,25.4 68.58,26.67 v60.96,26.67
VPTAT_REF
  Top 0.152: U1.5 35.56,23.5 | 35.56,23.5 36.62,23.5 38.31,25.19 | 38.31,25.19 C10.1 38.52,22.91 C13.1 | R13.2 48.68,22.01 49.53,22.86 49.53,24.13 48.59,25.07 U7.1 41.92,25.07 40.87,26.13 39.58,26.13 38.64,25.19 38.31,25.19 | TP4.TP 35.56,23.5
XTAL1
  Top 0.152: C19.2 22.59,8.2 Y1.1 22.98,9.9 23.59,10.51 U9.7
XTAL2
  Top 0.152: C20.2 27.34,5.93 25.91,4.5 Y1.3 24.64,4.5 24.13,5.01 24.13,14.5 24.39,14.76 U9.8
(copper drawn outside any net)
  shapes: Top area x31

### Text on the board
Top: T4